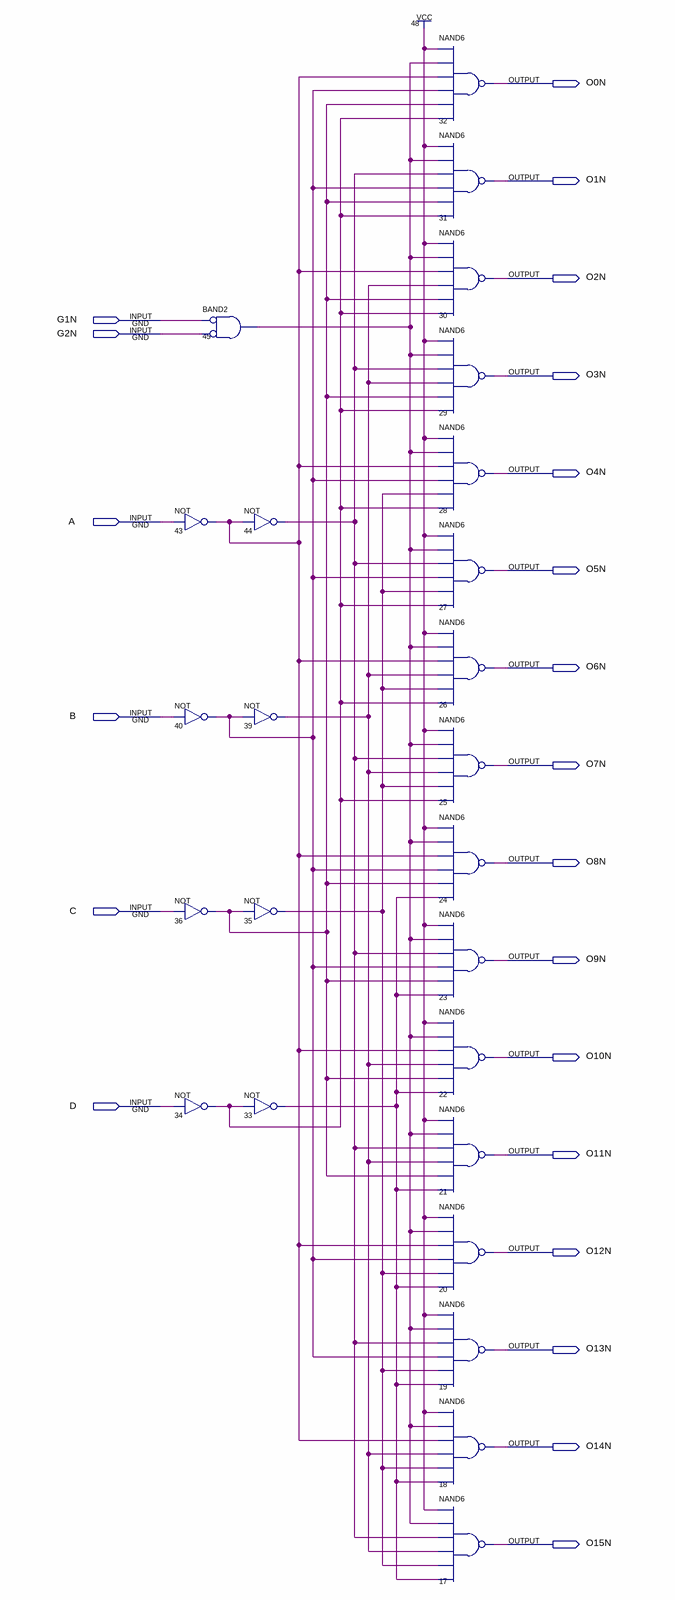
[diagram p0: schematic sheet]
// Quartus schematic ALP74LS154.bdf as structural Verilog: 25 symbols, 22 pins
module ALP74LS154 (
  input  G1N,
  input  G2N,
  input  A,
  input  B,
  input  C,
  input  D,
  output O0N,
  output O1N,
  output O2N,
  output O3N,
  output O4N,
  output O5N,
  output O6N,
  output O7N,
  output O8N,
  output O9N,
  output O10N,
  output O11N,
  output O12N,
  output O13N,
  output O14N,
  output O15N
);

  wire n33_out, n34_out, n35_out, n36_out, n39_out, n40_out, n43_out, n44_out, n45_out;

  not u_43 (n43_out, A);
  not u_40 (n40_out, B);
  not u_36 (n36_out, C);
  not u_34 (n34_out, D);
  and u_45 (n45_out, ~G1N, ~G2N);  // BAND2
  not u_44 (n44_out, n43_out);
  not u_39 (n39_out, n40_out);
  not u_35 (n35_out, n36_out);
  not u_33 (n33_out, n34_out);
  nand u_32 (O0N, 1'b1, n45_out, n43_out, n40_out, n36_out, n34_out);
  nand u_31 (O1N, 1'b1, n45_out, n44_out, n40_out, n36_out, n34_out);
  nand u_30 (O2N, 1'b1, n45_out, n43_out, n39_out, n36_out, n34_out);
  nand u_29 (O3N, 1'b1, n45_out, n44_out, n39_out, n36_out, n34_out);
  nand u_28 (O4N, 1'b1, n45_out, n43_out, n40_out, n35_out, n34_out);
  nand u_27 (O5N, 1'b1, n45_out, n44_out, n40_out, n35_out, n34_out);
  nand u_26 (O6N, 1'b1, n45_out, n43_out, n39_out, n35_out, n34_out);
  nand u_25 (O7N, 1'b1, n45_out, n44_out, n39_out, n35_out, n34_out);
  nand u_24 (O8N, 1'b1, n45_out, n43_out, n40_out, n36_out, n33_out);
  nand u_23 (O9N, 1'b1, n45_out, n44_out, n40_out, n36_out, n33_out);
  nand u_22 (O10N, 1'b1, n45_out, n43_out, n39_out, n36_out, n33_out);
  nand u_21 (O11N, 1'b1, n45_out, n44_out, n39_out, n36_out, n33_out);
  nand u_20 (O12N, 1'b1, n45_out, n43_out, n40_out, n35_out, n33_out);
  nand u_19 (O13N, 1'b1, n45_out, n44_out, n40_out, n35_out, n33_out);
  nand u_18 (O14N, 1'b1, n45_out, n43_out, n39_out, n35_out, n33_out);
  nand u_17 (O15N, 1'b1, n45_out, n44_out, n39_out, n35_out, n33_out);
endmodule
